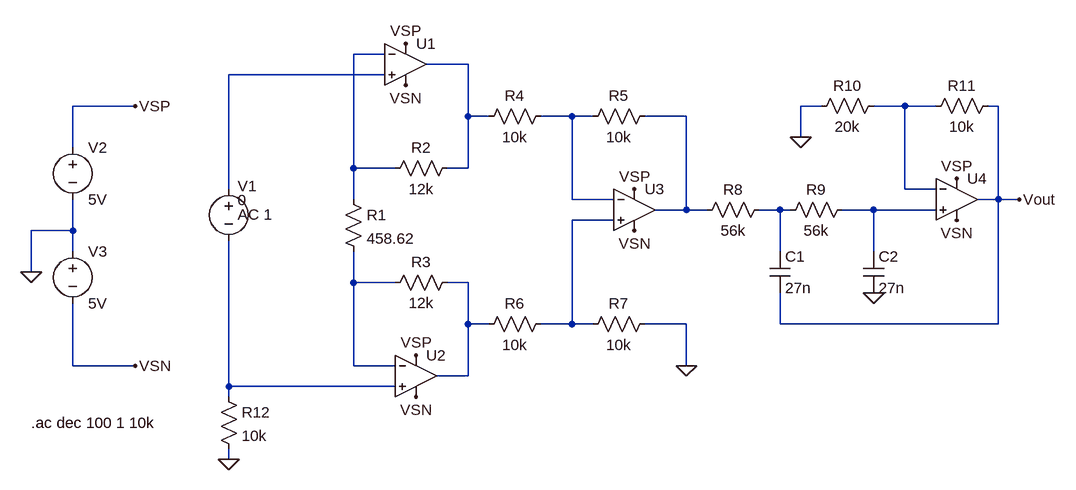
[diagram p0: schematic Exercitiu.asc]
Exercitiu.asc, the LTspice schematic file:
Version 4
SHEET 1 1460 680
WIRE 416 -64 368 -64
WIRE 544 -48 480 -48
WIRE 416 -32 176 -32
WIRE 32 16 -64 16
WIRE 1088 16 1056 16
WIRE 1216 16 1168 16
WIRE 1264 16 1216 16
WIRE 1360 16 1344 16
WIRE 544 32 544 -48
WIRE 576 32 544 32
WIRE 704 32 656 32
WIRE 736 32 704 32
WIRE 880 32 816 32
WIRE 1056 64 1056 16
WIRE -64 80 -64 16
WIRE 368 112 368 -64
WIRE 432 112 368 112
WIRE 544 112 544 32
WIRE 544 112 512 112
WIRE 176 144 176 -32
WIRE 1216 144 1216 16
WIRE 1264 144 1216 144
WIRE 368 160 368 112
WIRE 704 160 704 32
WIRE 768 160 704 160
WIRE 1360 160 1360 16
WIRE 1360 160 1328 160
WIRE 1392 160 1360 160
WIRE 880 176 880 32
WIRE 880 176 832 176
WIRE 912 176 880 176
WIRE 1024 176 992 176
WIRE 1040 176 1024 176
WIRE 1168 176 1120 176
WIRE 1264 176 1168 176
WIRE 768 192 704 192
WIRE -64 208 -64 160
WIRE -64 208 -128 208
WIRE -64 240 -64 208
WIRE 1024 240 1024 176
WIRE 1168 240 1168 176
WIRE -128 272 -128 208
WIRE 368 288 368 240
WIRE 432 288 368 288
WIRE 544 288 512 288
WIRE 544 352 544 288
WIRE 576 352 544 352
WIRE 704 352 704 192
WIRE 704 352 656 352
WIRE 736 352 704 352
WIRE 880 352 816 352
WIRE 1024 352 1024 304
WIRE 1360 352 1360 160
WIRE 1360 352 1024 352
WIRE -64 416 -64 320
WIRE 32 416 -64 416
WIRE 368 416 368 288
WIRE 432 416 368 416
WIRE 880 416 880 352
WIRE 544 432 544 352
WIRE 544 432 496 432
WIRE 176 448 176 224
WIRE 432 448 176 448
WIRE 176 464 176 448
WIRE 176 560 176 544
FLAG -128 272 0
FLAG 32 16 VSP
FLAG 32 416 VSN
FLAG 1168 304 0
FLAG 880 416 0
FLAG 176 560 0
FLAG 448 -80 VSP
FLAG 800 144 VSP
FLAG 1296 128 VSP
FLAG 464 400 VSP
FLAG 464 464 VSN
FLAG 448 -16 VSN
FLAG 800 208 VSN
FLAG 1296 192 VSN
FLAG 1056 64 0
FLAG 1392 160 Vout
SYMBOL voltage 176 128 R0
WINDOW 0 14 11 Left 2
WINDOW 3 14 33 Left 2
WINDOW 123 14 55 Left 2
SYMATTR InstName V1
SYMATTR Value 0
SYMATTR Value2 AC 1
SYMBOL voltage -64 64 R0
SYMATTR InstName V2
SYMATTR Value 5V
SYMBOL voltage -64 224 R0
SYMATTR InstName V3
SYMATTR Value 5V
SYMBOL OpAmps/UniversalOpamp2 448 -48 R0
SYMATTR InstName U1
SYMBOL OpAmps/UniversalOpamp2 464 432 R0
SYMATTR InstName U2
SYMBOL OpAmps/UniversalOpamp2 800 176 R0
SYMATTR InstName U3
SYMBOL OpAmps/UniversalOpamp2 1296 160 R0
SYMATTR InstName U4
SYMBOL res 352 144 R0
SYMATTR InstName R1
SYMATTR Value 458.62
SYMBOL res 528 96 R90
WINDOW 0 0 56 VBottom 2
WINDOW 3 32 56 VTop 2
SYMATTR InstName R2
SYMATTR Value 12k
SYMBOL res 528 272 R90
WINDOW 0 0 56 VBottom 2
WINDOW 3 32 56 VTop 2
SYMATTR InstName R3
SYMATTR Value 12k
SYMBOL res 672 16 R90
WINDOW 0 0 56 VBottom 2
WINDOW 3 32 56 VTop 2
SYMATTR InstName R4
SYMATTR Value 10k
SYMBOL res 832 16 R90
WINDOW 0 0 56 VBottom 2
WINDOW 3 32 56 VTop 2
SYMATTR InstName R5
SYMATTR Value 10k
SYMBOL res 672 336 R90
WINDOW 0 0 56 VBottom 2
WINDOW 3 32 56 VTop 2
SYMATTR InstName R6
SYMATTR Value 10k
SYMBOL res 832 336 R90
WINDOW 0 0 56 VBottom 2
WINDOW 3 32 56 VTop 2
SYMATTR InstName R7
SYMATTR Value 10k
SYMBOL res 1008 160 R90
WINDOW 0 0 56 VBottom 2
WINDOW 3 32 56 VTop 2
SYMATTR InstName R8
SYMATTR Value 56k
SYMBOL res 1136 160 R90
WINDOW 0 0 56 VBottom 2
WINDOW 3 32 56 VTop 2
SYMATTR InstName R9
SYMATTR Value 56k
SYMBOL res 1184 0 R90
WINDOW 0 0 56 VBottom 2
WINDOW 3 32 56 VTop 2
SYMATTR InstName R10
SYMATTR Value 20k
SYMBOL res 1360 0 R90
WINDOW 0 0 56 VBottom 2
WINDOW 3 32 56 VTop 2
SYMATTR InstName R11
SYMATTR Value 10k
SYMBOL cap 1008 240 R0
SYMATTR InstName C1
SYMATTR Value 27n
SYMBOL cap 1152 240 R0
SYMATTR InstName C2
SYMATTR Value 27n
SYMBOL res 160 448 R0
SYMATTR InstName R12
SYMATTR Value 10k
TEXT -128 504 Left 2 !.ac dec 100 1 10k

The netlist it stands for:
* Exercitiu.asc
V1 N003 N012 0 AC 1
V2 VSP 0 5V
V3 0 VSN 5V
XU1 N003 N001 VSP VSN N002 level.2 Avol=1Meg GBW=10Meg Slew=10Meg ilimit=25m rail=0 Vos=0 phimargin=45 en=0 enk=0 in=0 ink=0 Rin=500Meg  ; pins IN+ IN- V+ V- OUT
XU2 N012 N010 VSP VSN N011 level.2 Avol=1Meg GBW=10Meg Slew=10Meg ilimit=25m rail=0 Vos=0 phimargin=45 en=0 enk=0 in=0 ink=0 Rin=500Meg  ; pins IN+ IN- V+ V- OUT
XU3 N009 N005 VSP VSN N006 level.2 Avol=1Meg GBW=10Meg Slew=10Meg ilimit=25m rail=0 Vos=0 phimargin=45 en=0 enk=0 in=0 ink=0 Rin=500Meg  ; pins IN+ IN- V+ V- OUT
XU4 N008 N004 VSP VSN Vout level.2 Avol=1Meg GBW=10Meg Slew=10Meg ilimit=25m rail=0 Vos=0 phimargin=45 en=0 enk=0 in=0 ink=0 Rin=500Meg  ; pins IN+ IN- V+ V- OUT
R1 N001 N010 458.62
R2 N002 N001 12k
R3 N011 N010 12k
R4 N005 N002 10k
R5 N006 N005 10k
R6 N009 N011 10k
R7 0 N009 10k
R8 N007 N006 56k
R9 N008 N007 56k
R10 N004 0 20k
R11 Vout N004 10k
C1 N007 Vout 27n
C2 N008 0 27n
R12 N012 0 10k
.ac dec 100 1 10k
.lib UniversalOpamps2.sub
.backanno
.end